# Altium project ARM_.PrjPcb
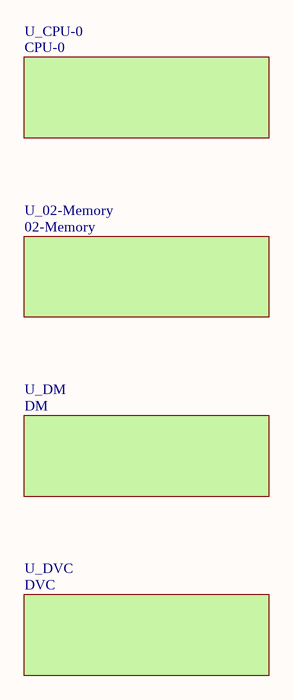
[diagram p0: Main.SchDoc]
5 sheets, 127 parts. Net scope: global (net labels, ports and power ports of the same name join across sheets).
Sheets:
  Main.SchDoc
    U_CPU-0 = CPU-0.SchDoc
    U_02-Memory = 02-Memory.SchDoc
    U_DM = DM.SchDoc
    U_DVC = DVC.SchDoc

## Sheet Main.SchDoc
size A4

### Sub-sheets
U_02-Memory = 02-Memory: no entries
U_CPU-0 = CPU-0: no entries
U_DM = DM: no entries
U_DVC = DVC: no entries

## Sheet CPU-0.SchDoc
size A3
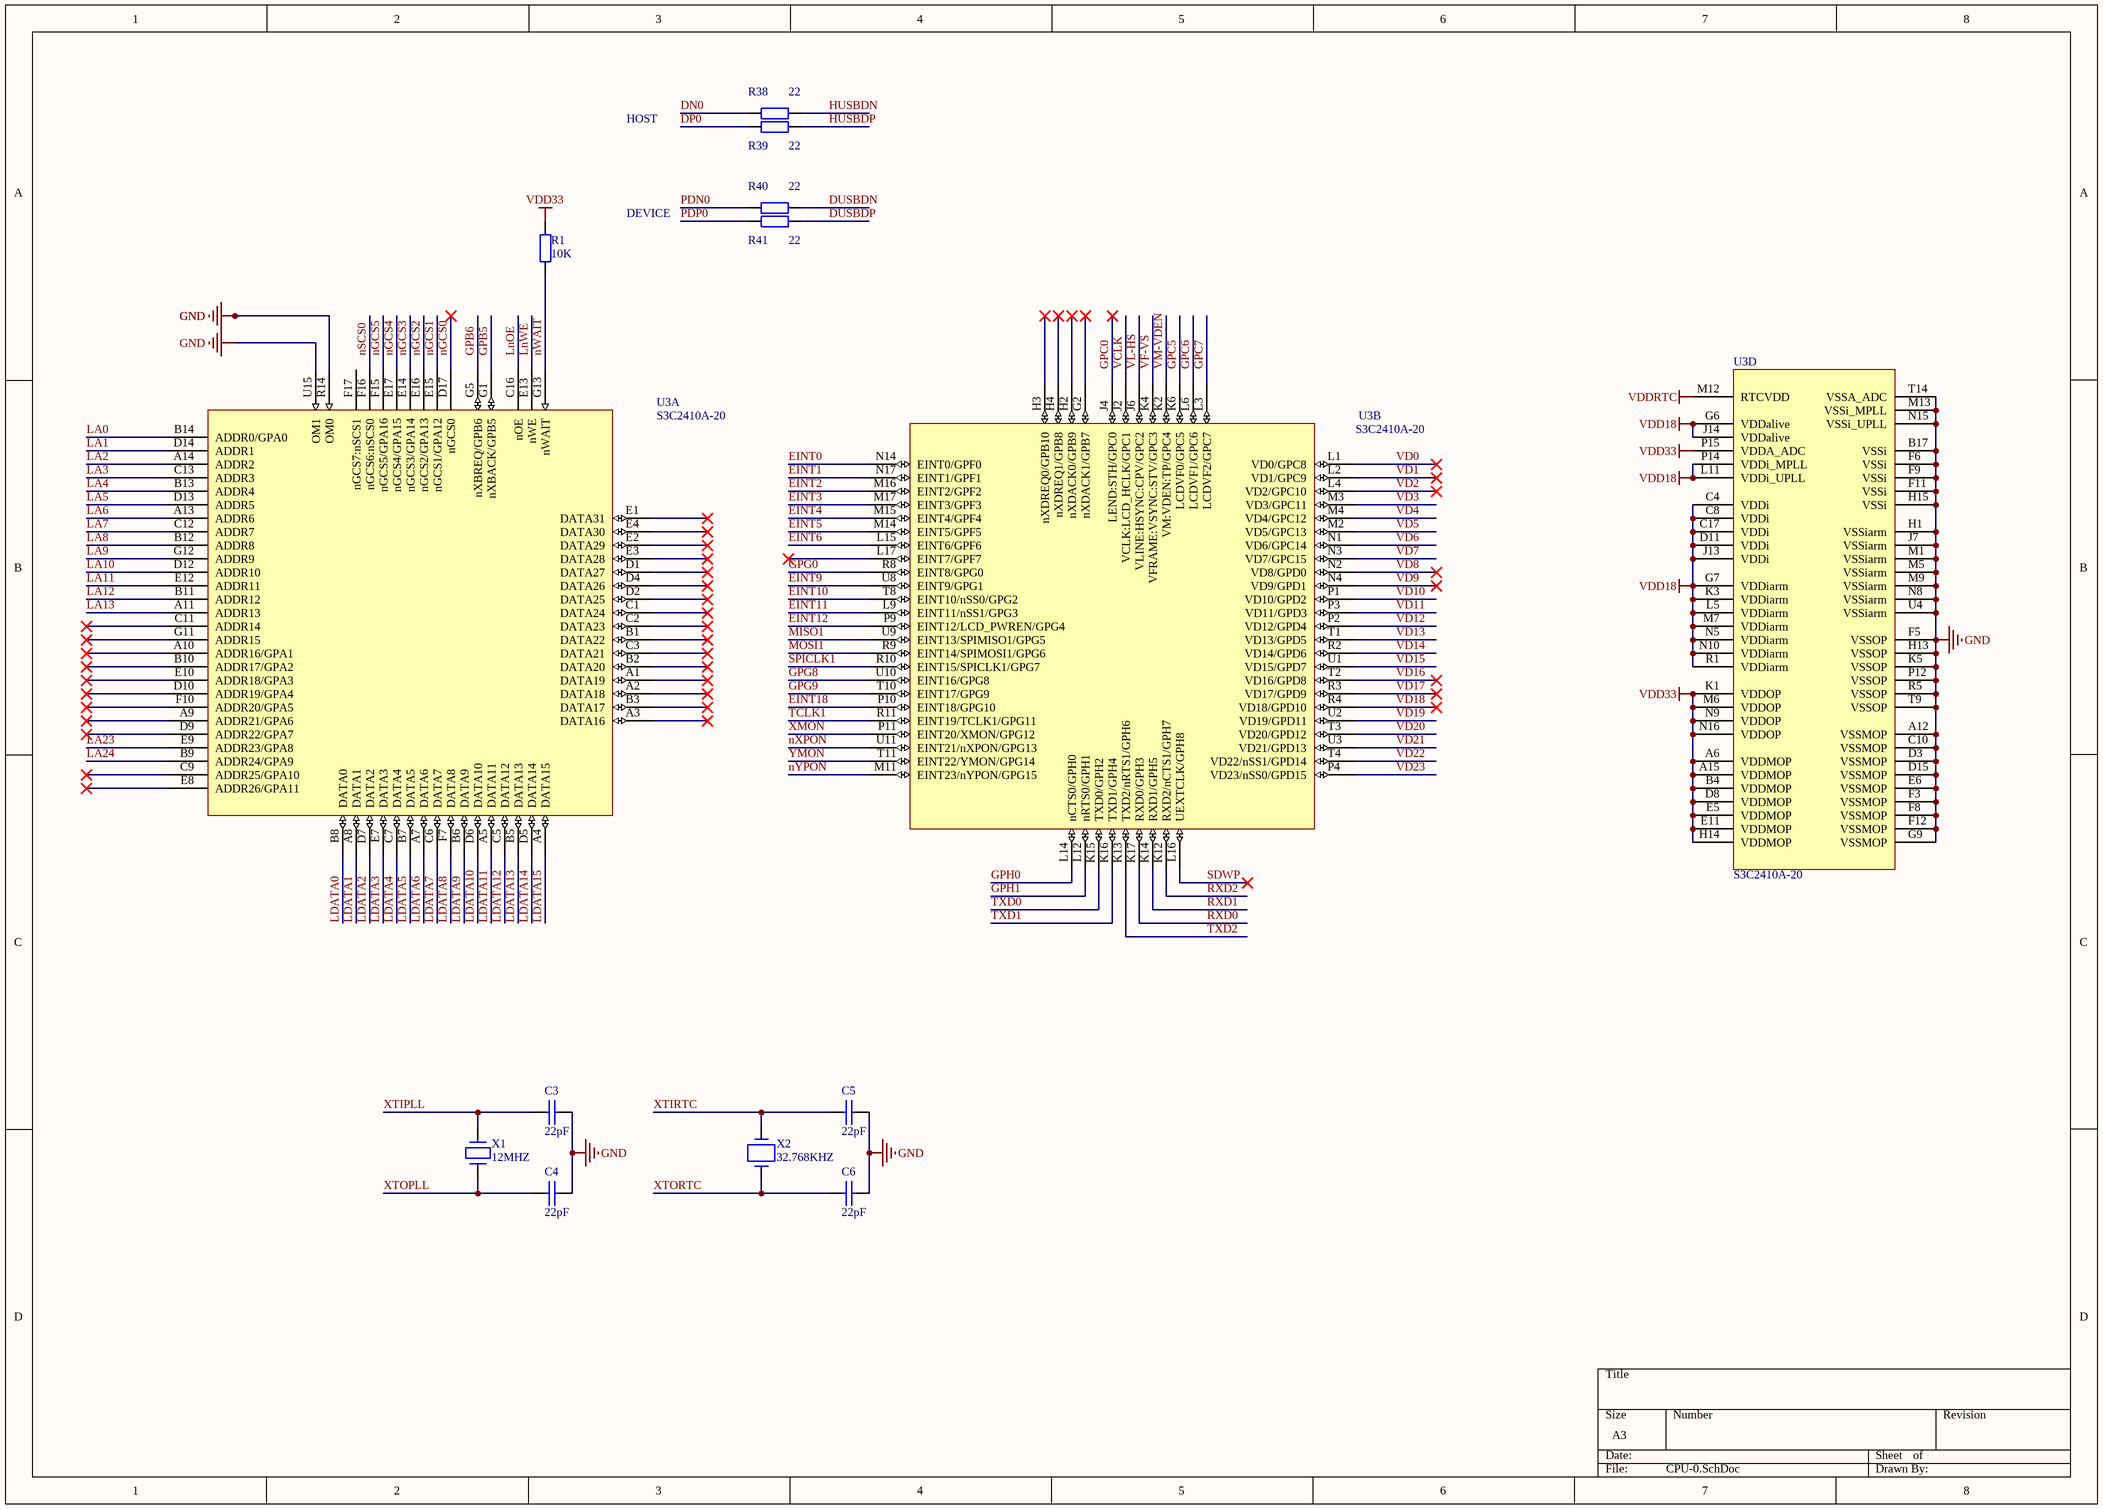
[diagram p1: CPU-0.SchDoc]

### Parts
C3  22pF  [A型钽电容]
C4  22pF  [A型钽电容]
C5  22pF  [A型钽电容]
C6  22pF  [A型钽电容]
R1  value 10K  [0603R]  (hidden comment: Res2)
R38  value 22  [0603R]  (hidden comment: Res2)
R39  value 22  [0603R]  (hidden comment: Res2)
R40  value 22  [0603R]  (hidden comment: Res2)
R41  value 22  [0603R]  (hidden comment: Res2)
U3  S3C2410A-20  [FBGA272]  (parts A,B,D of 4)
X1  12MHZ  [OSC2PR-1]
X2  32.768KHZ  [XTAL-B]

### Nets
GND: C3.2 C4.2 C5.2 C6.2 U3.A12(VSSMOP) U3.B17(VSSi) U3.C10(VSSMOP) U3.D3(VSSMOP) U3.D15(VSSMOP) U3.E6(VSSMOP) U3.F3(VSSMOP) U3.F5(VSSOP) U3.F6(VSSi) U3.F8(VSSMOP) U3.F9(VSSi) U3.F11(VSSi) U3.F12(VSSMOP) U3.G9(VSSMOP) U3.H1(VSSiarm) U3.H13(VSSOP) U3.H15(VSSi) U3.J7(VSSiarm) U3.K5(VSSOP) U3.M1(VSSiarm) U3.M5(VSSiarm) U3.M9(VSSiarm) U3.M13(VSSi_MPLL) U3.N8(VSSiarm) U3.N15(VSSi_UPLL) U3.P12(VSSOP) U3.R5(VSSOP) U3.R14(OM0) U3.T9(VSSOP) U3.T14(VSSA_ADC) U3.U4(VSSiarm) U3.U15(OM1)
RXD0: U3.K17(RXD0/GPH3)
RXD1: U3.K14(RXD1/GPH5)
TXD0: U3.K15(TXD0/GPH2)
TXD1: U3.K16(TXD1/GPH4)
VDD18: U3.C4(VDDi) U3.C8(VDDi) U3.C17(VDDi) U3.D11(VDDi) U3.G6(VDDalive) U3.G7(VDDiarm) U3.J13(VDDi) U3.J14(VDDalive) U3.K3(VDDiarm) U3.L5(VDDiarm) U3.L11(VDDi_UPLL) U3.M7(VDDiarm) U3.N5(VDDiarm) U3.N10(VDDiarm) U3.P14(VDDi_MPLL) U3.R1(VDDiarm)
VDD33: R1.2 U3.A6(VDDMOP) U3.A15(VDDMOP) U3.B4(VDDMOP) U3.D8(VDDMOP) U3.E5(VDDMOP) U3.E11(VDDMOP) U3.H14(VDDMOP) U3.K1(VDDOP) U3.M6(VDDOP) U3.N9(VDDOP) U3.N16(VDDOP) U3.P15(VDDA_ADC)
VDDRTC: U3.M12(RTCVDD)
DN0: R38.1
DP0: R39.1
DUSBDN: R40.2
DUSBDP: R41.2
EINT0: U3.N14(EINT0/GPF0)
EINT1: U3.N17(EINT1/GPF1)
EINT2: U3.M16(EINT2/GPF2)
EINT3: U3.M17(EINT3/GPF3)
EINT4: U3.M15(EINT4/GPF4)
EINT5: U3.M14(EINT5/GPF5)
EINT6: U3.L15(EINT6/GPF6)
EINT9: U3.U8(EINT9/GPG1)
EINT10: U3.T8(EINT10/nSS0/GPG2)
EINT11: U3.L9(EINT11/nSS1/GPG3)
EINT12: U3.P9(EINT12/LCD_PWREN/GPG4)
EINT18: U3.P10(EINT18/GPG10)
GPB5: U3.G1(nXBACK/GPB5)
GPB6: U3.G5(nXBREQ/GPB6)
GPC0: U3.J4(LEND:STH/GPC0)
GPC5: U3.K6(LCDVF0/GPC5)
GPC6: U3.L6(LCDVF1/GPC6)
GPC7: U3.L3(LCDVF2/GPC7)
GPG0: U3.R8(EINT8/GPG0)
GPG8: U3.U10(EINT16/GPG8)
GPG9: U3.T10(EINT17/GPG9)
GPH0: U3.L14(nCTS0/GPH0)
GPH1: U3.L12(nRTS0/GPH1)
HUSBDN: R38.2
HUSBDP: R39.2
LA0: U3.B14(ADDR0/GPA0)
LA1: U3.D14(ADDR1)
LA2: U3.A14(ADDR2)
LA3: U3.C13(ADDR3)
LA4: U3.B13(ADDR4)
LA5: U3.D13(ADDR5)
LA6: U3.A13(ADDR6)
LA7: U3.C12(ADDR7)
LA8: U3.B12(ADDR8)
LA9: U3.G12(ADDR9)
LA10: U3.D12(ADDR10)
LA11: U3.E12(ADDR11)
LA12: U3.B11(ADDR12)
LA13: U3.A11(ADDR13)
LA23: U3.E9(ADDR23/GPA8)
LA24: U3.B9(ADDR24/GPA9)
LDATA0: U3.B8(DATA0)
LDATA1: U3.A8(DATA1)
LDATA2: U3.D7(DATA2)
LDATA3: U3.E7(DATA3)
LDATA4: U3.C7(DATA4)
LDATA5: U3.B7(DATA5)
LDATA6: U3.A7(DATA6)
LDATA7: U3.C6(DATA7)
LDATA8: U3.F7(DATA8)
LDATA9: U3.B6(DATA9)
LDATA10: U3.D6(DATA10)
LDATA11: U3.A5(DATA11)
LDATA12: U3.C5(DATA12)
LDATA13: U3.B5(DATA13)
LDATA14: U3.D5(DATA14)
LDATA15: U3.A4(DATA15)
LnOE: U3.C16(nOE)
LnWE: U3.E13(nWE)
MISO1: U3.U9(EINT13/SPIMISO1/GPG5)
MOSI1: U3.R9(EINT14/SPIMOSI1/GPG6)
nGCS0: U3.D17(nGCS0)
nGCS1: U3.E15(nGCS1/GPA12)
nGCS2: U3.E16(nGCS2/GPA13)
nGCS3: U3.E14(nGCS3/GPA14)
nGCS4: U3.E17(nGCS4/GPA15)
nGCS5: U3.F15(nGCS5/GPA16)
nSCS0: U3.F16(nGCS6:nSCS0)
nWAIT: R1.1 U3.G13(nWAIT)
nXPON: U3.U11(EINT21/nXPON/GPG13)
nYPON: U3.M11(EINT23/nYPON/GPG15)
PDN0: R40.1
PDP0: R41.1
RXD2: U3.K12(RXD2/nCTS1/GPH7)
SDWP: U3.L16(UEXTCLK/GPH8)
SPICLK1: U3.R10(EINT15/SPICLK1/GPG7)
TCLK1: U3.R11(EINT19/TCLK1/GPG11)
TXD2: U3.K13(TXD2/nRTS1/GPH6)
VCLK: U3.J2(VCLK:LCD_HCLK/GPC1)
VD0: U3.L1(VD0/GPC8)
VD1: U3.L2(VD1/GPC9)
VD2: U3.L4(VD2/GPC10)
VD3: U3.M3(VD3/GPC11)
VD4: U3.M4(VD4/GPC12)
VD5: U3.M2(VD5/GPC13)
VD6: U3.N1(VD6/GPC14)
VD7: U3.N3(VD7/GPC15)
VD8: U3.N2(VD8/GPD0)
VD9: U3.N4(VD9/GPD1)
VD10: U3.P1(VD10/GPD2)
VD11: U3.P3(VD11/GPD3)
VD12: U3.P2(VD12/GPD4)
VD13: U3.T1(VD13/GPD5)
VD14: U3.R2(VD14/GPD6)
VD15: U3.U1(VD15/GPD7)
VD16: U3.T2(VD16/GPD8)
VD17: U3.R3(VD17/GPD9)
VD18: U3.R4(VD18/GPD10)
VD19: U3.U2(VD19/GPD11)
VD20: U3.T3(VD20/GPD12)
VD21: U3.U3(VD21/GPD13)
VD22: U3.T4(VD22/nSS1/GPD14)
VD23: U3.P4(VD23/nSS0/GPD15)
VF-VS: U3.K4(VFRAME:VSYNC:STV/GPC3)
VL-HS: U3.J6(VLINE:HSYNC:CPV/GPC2)
VM-VDEN: U3.K2(VM:VDEN:TP/GPC4)
XMON: U3.P11(EINT20/XMON/GPG12)
XTIPLL: C3.1 X1.2
XTIRTC: C5.1 X2.2
XTOPLL: C4.1 X1.1
XTORTC: C6.1 X2.1
YMON: U3.T11(EINT22/YMON/GPG14)

Not connected (* = marked no-connect by the designer): U3 A1(DATA19)* A2(DATA18)* A3(DATA16)* A9(ADDR21/GPA6)* A10(ADDR16/GPA1)* B1(DATA22)* B2(DATA20)* B3(DATA17)* B10(ADDR17/GPA2)* C1(DATA24)* C2(DATA23)* C3(DATA21)* C9(ADDR25/GPA10)* C11(ADDR14)* D1(DATA27)* D2(DATA25)* D4(DATA26)* D9(ADDR22/GPA7)* D10(ADDR19/GPA4)* E1(DATA31)* E2(DATA29)* E3(DATA28)* E4(DATA30)* E8(ADDR26/GPA11)* E10(ADDR18/GPA3)* F10(ADDR20/GPA5)* F17(nGCS7:nSCS1) G2(nXDACK1/GPB7)* G11(ADDR15)* H2(nXDACK0/GPB9)* H3(nXDREQ0/GPB10)* H4(nXDREQ1/GPB8)* L17(EINT7/GPF7)*

### Notes on the sheet
- HOST
- DEVICE

### Library data of the parts
C3-C6 = CAP_1: Capacitor
R1 R38-R41 = Res2_1: Resistor; Published: 8-Jun-2000; LatestRevisionDate: 17-Jul-2002; LatestRevisionNote: Re-released for DXP Platform.; PackageReference: AXIAL-0.4; Publisher: Altium Limited
U3 = S3C2410A-20: 32-Bit RISC Microprocessor, 200 MHz, 1.8V (Core), 3.3V (Memory and IO), 272-Pin FBGA; Published: 6-Oct-2005; LatestRevisionDate: 13-Apr-2006; LatestRevisionNote: IPC-7351 Footprint Added.; DatasheetVersion: rev1.0, Mar-2004; PackageVersion: Mar-2004; PackageReference: FBGA272; Publisher: Altium Limited; PackageDescription: 272-Ball Ball Grid Array 0.8 mm Pitch; ComponentLink1Description: Manufacturer Link; ComponentLink1URL: http://www.samsung.com; ComponentLink2Description: Datasheet; ComponentLink2URL: http://www.samsung.com/Products/Semiconductor/SystemLSI/MobileSolutions/MobileASSP/MobileComputing/S3C2410/um_s3c2410a_manual_r10.pdf
X1 = CRYSTAL: Part Field 1: 1; Part Field 5: 1; Part Field 6: 1000K
X2 = CRYSTAL_1: Text Field1: 20; Text Field2: 20

## Sheet 02-Memory.SchDoc
size A3
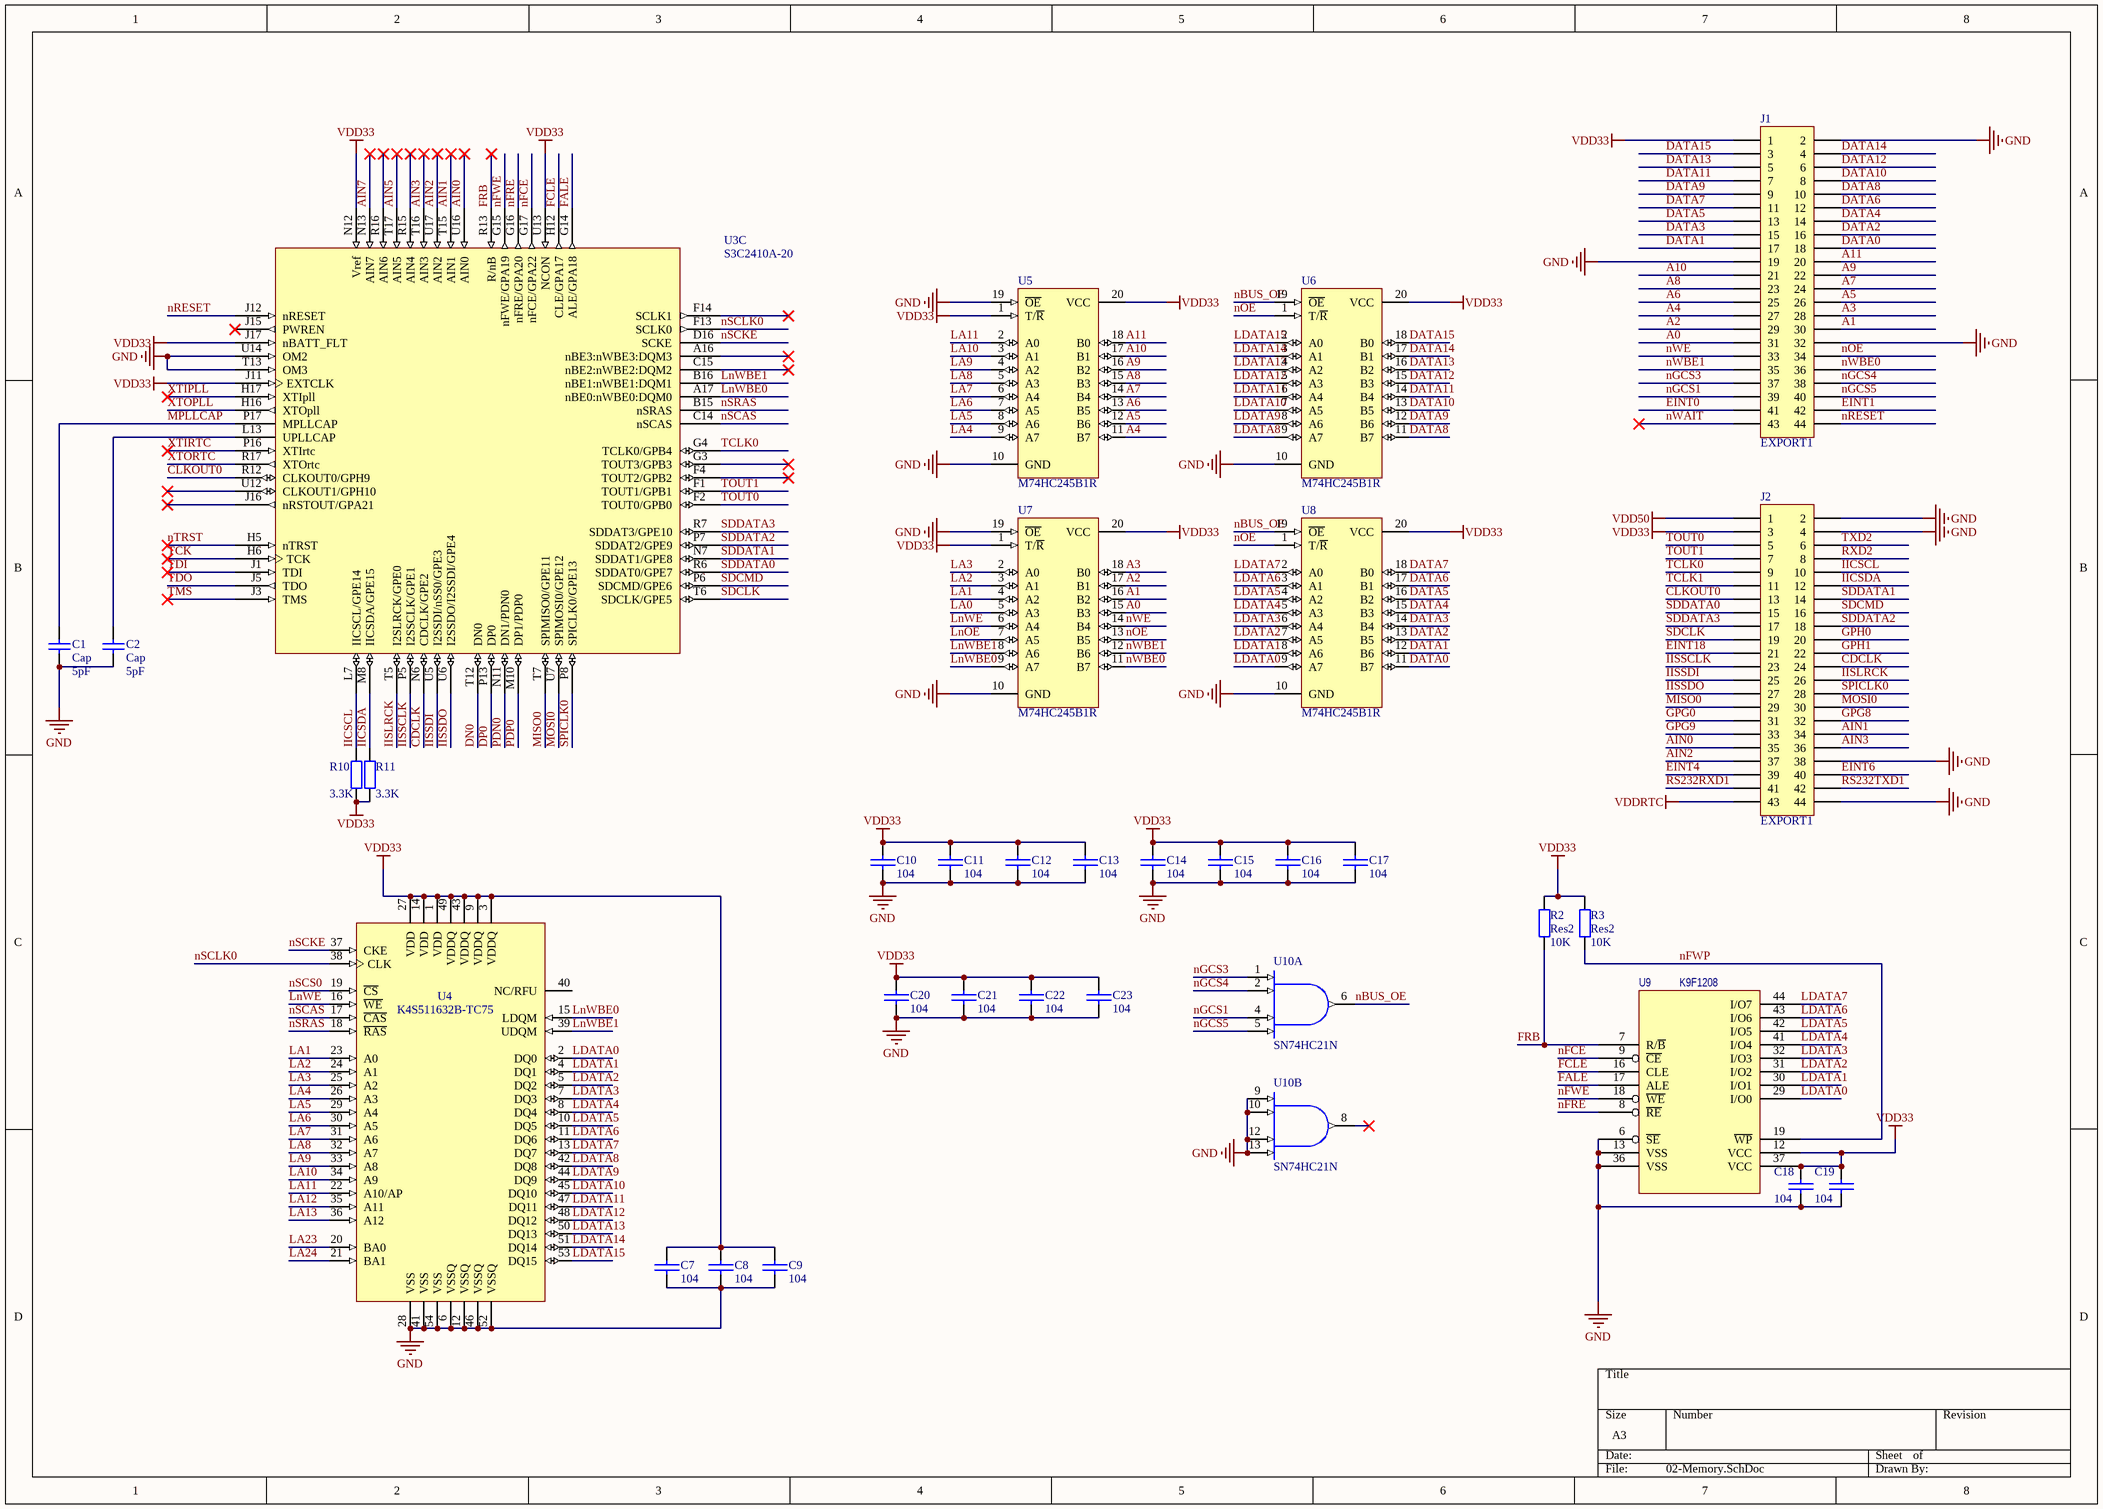
[diagram p2: 02-Memory.SchDoc]

### Parts
C1  Cap  value 5pF  [RAD-0.3]
C2  Cap  value 5pF  [RAD-0.3]
C7  104  [A型钽电容]
C8  104  [A型钽电容]
C9  104  [A型钽电容]
C10  104  [A型钽电容]
C11  104  [A型钽电容]
C12  104  [A型钽电容]
C13  104  [A型钽电容]
C14  104  [A型钽电容]
C15  104  [A型钽电容]
C16  104  [A型钽电容]
C17  104  [A型钽电容]
C18  104  [A型钽电容]
C19  104  [A型钽电容]
C20  104  [A型钽电容]
C21  104  [A型钽电容]
C22  104  [A型钽电容]
C23  104  [A型钽电容]
J1  EXPORT1  [HDR2X22]
J2  EXPORT1  [HDR2X22]
R2  Res2  value 10K  [0603R]
R3  Res2  value 10K  [0603R]
R10  value 3.3K  [0603R]  (hidden comment: Res2)
R11  value 3.3K  [0603R]  (hidden comment: Res2)
U3  S3C2410A-20  [FBGA272]  (part C of 4)
U4  K4S511632B-TC75  [54_TSOP2_400AF_N]
U5  M74HC245B1R  [SOP-20]
U6  M74HC245B1R  [SOP-20]
U7  M74HC245B1R  [SOP-20]
U8  M74HC245B1R  [SOP-20]
U9  K9F1208  [TSOP48]
U10  SN74HC21N  [N014]  (parts A,B of 2)

### Nets
GND: C1.1 C2.1 C7.2 C8.2 C9.2 C10.2 C11.2 C12.2 C13.2 C14.2 C15.2 C16.2 C17.2 C18.2 C19.2 C20.2 C21.2 C22.2 C23.2 J1.2 J1.19 J1.32 J2.2 J2.4 J2.38 J2.44 U3.T13(OM3) U3.U14(OM2) U4.6(VSSQ) U4.12(VSSQ) U4.28(VSS) U4.41(VSS) U4.46(VSSQ) U4.52(VSSQ) U4.54(VSS) U5.10(GND) U5.19(~{OE}) U6.10(GND) U7.10(GND) U7.19(~{OE}) U8.10(GND) U9.6(~{SE}) U9.13(VSS) U9.36(VSS) U10.7(GND) U10.9(A) U10.10(B) U10.12(C) U10.13(D)
nRESET: J1.44 U3.J12(nRESET)
nTRST: U3.H5(nTRST)
RS232RXD1: J2.41
RS232TXD1: J2.42
TCK: U3.H6(TCK)
TDI: U3.J1(TDI)
TDO: U3.J5(TDO)
TMS: U3.J3(TMS)
VCC: U10.14(VCC)
VDD33: C7.1 C8.1 C9.1 C10.1 C11.1 C12.1 C13.1 C14.1 C15.1 C16.1 C17.1 C18.1 C19.1 C20.1 C21.1 C22.1 C23.1 J1.1 J2.3 R2.2 R3.2 R10.1 R11.1 U3.J11(EXTCLK) U3.J17(nBATT_FLT) U3.N12(Vref) U3.U13(NCON) U4.1(VDD) U4.3(VDDQ) U4.9(VDDQ) U4.14(VDD) U4.27(VDD) U4.43(VDDQ) U4.49(VDDQ) U5.1(T/~{R}) U5.20(VCC) U6.20(VCC) U7.1(T/~{R}) U7.20(VCC) U8.20(VCC) U9.12(VCC) U9.37(VCC)
VDD50: J2.1
VDDRTC: J2.43
A0: J1.31 U7.15(B3)
A1: J1.30 U7.16(B2)
A2: J1.29 U7.17(B1)
A3: J1.28 U7.18(B0)
A4: J1.27 U5.11(B7)
A5: J1.26 U5.12(B6)
A6: J1.25 U5.13(B5)
A7: J1.24 U5.14(B4)
A8: J1.23 U5.15(B3)
A9: J1.22 U5.16(B2)
A10: J1.21 U5.17(B1)
A11: J1.20 U5.18(B0)
AIN0: J2.35 U3.U16(AIN0)
AIN1: J2.34 U3.T15(AIN1)
AIN2: J2.37 U3.U17(AIN2)
AIN3: J2.36 U3.T16(AIN3)
AIN5: U3.T17(AIN5)
AIN7: U3.N13(AIN7)
CDCLK: J2.24 U3.N6(CDCLK/GPE2)
CLKOUT0: J2.13 U3.R12(CLKOUT0/GPH9)
DATA0: J1.18 U8.11(B7)
DATA1: J1.17 U8.12(B6)
DATA2: J1.16 U8.13(B5)
DATA3: J1.15 U8.14(B4)
DATA4: J1.14 U8.15(B3)
DATA5: J1.13 U8.16(B2)
DATA6: J1.12 U8.17(B1)
DATA7: J1.11 U8.18(B0)
DATA8: J1.10 U6.11(B7)
DATA9: J1.9 U6.12(B6)
DATA10: J1.8 U6.13(B5)
DATA11: J1.7 U6.14(B4)
DATA12: J1.6 U6.15(B3)
DATA13: J1.5 U6.16(B2)
DATA14: J1.4 U6.17(B1)
DATA15: J1.3 U6.18(B0)
DN0: U3.T12(DN0)
DP0: U3.P13(DP0)
EINT0: J1.41
EINT1: J1.42
EINT4: J2.39
EINT6: J2.40
EINT18: J2.21
FALE: U3.G14(ALE/GPA18) U9.17(ALE)
FCLE: U3.H12(CLE/GPA17) U9.16(CLE)
FRB: R2.1 U3.R13(R/nB) U9.7(R/~{B})
GPG0: J2.31
GPG8: J2.32
GPG9: J2.33
GPH0: J2.20
GPH1: J2.22
IICSCL: J2.10 R10.2 U3.L7(IICSCL/GPE14)
IICSDA: J2.12 R11.2 U3.M8(IICSDA/GPE15)
IISLRCK: J2.26 U3.T5(I2SLRCK/GPE0)
IISSCLK: J2.23 U3.P5(I2SSCLK/GPE1)
IISSDI: J2.25 U3.U5(I2SSDI/nSS0/GPE3)
IISSDO: J2.27 U3.U6(I2SSDO/I2SSDI/GPE4)
LA0: U7.5(A3)
LA1: U4.23(A0) U7.4(A2)
LA2: U4.24(A1) U7.3(A1)
LA3: U4.25(A2) U7.2(A0)
LA4: U4.26(A3) U5.9(A7)
LA5: U4.29(A4) U5.8(A6)
LA6: U4.30(A5) U5.7(A5)
LA7: U4.31(A6) U5.6(A4)
LA8: U4.32(A7) U5.5(A3)
LA9: U4.33(A8) U5.4(A2)
LA10: U4.34(A9) U5.3(A1)
LA11: U4.22(A10/AP) U5.2(A0)
LA12: U4.35(A11)
LA13: U4.36(A12)
LA23: U4.20(BA0)
LA24: U4.21(BA1)
LDATA0: U4.2(DQ0) U8.9(A7) U9.29(I/O0)
LDATA1: U4.4(DQ1) U8.8(A6) U9.30(I/O1)
LDATA2: U4.5(DQ2) U8.7(A5) U9.31(I/O2)
LDATA3: U4.7(DQ3) U8.6(A4) U9.32(I/O3)
LDATA4: U4.8(DQ4) U8.5(A3) U9.41(I/O4)
LDATA5: U4.10(DQ5) U8.4(A2) U9.42(I/O5)
LDATA6: U4.11(DQ6) U8.3(A1) U9.43(I/O6)
LDATA7: U4.13(DQ7) U8.2(A0) U9.44(I/O7)
LDATA8: U4.42(DQ8) U6.9(A7)
LDATA9: U4.44(DQ9) U6.8(A6)
LDATA10: U4.45(DQ10) U6.7(A5)
LDATA11: U4.47(DQ11) U6.6(A4)
LDATA12: U4.48(DQ12) U6.5(A3)
LDATA13: U4.50(DQ13) U6.4(A2)
LDATA14: U4.51(DQ14) U6.3(A1)
LDATA15: U4.53(DQ15) U6.2(A0)
LnOE: U7.7(A5)
LnWBE0: U3.A17(nBE0:nWBE0:DQM0) U4.15(LDQM) U7.9(A7)
LnWBE1: U3.B16(nBE1:nWBE1:DQM1) U4.39(UDQM) U7.8(A6)
LnWE: U4.16(~{WE}) U7.6(A4)
MISO0: J2.29 U3.T7(SPIMISO0/GPE11)
MOSI0: J2.30 U3.U7(SPIMOSI0/GPE12)
MPLLCAP: C1.2 U3.P17(MPLLCAP)
nBUS_OE: U6.19(~{OE}) U8.19(~{OE}) U10.6(Y)
nFCE: U3.G17(nFCE/GPA22) U9.9(~{CE})
nFRE: U3.G16(nFRE/GPA20) U9.8(~{RE})
nFWE: U3.G15(nFWE/GPA19) U9.18(~{WE})
nFWP: R3.1 U9.19(~{WP})
nGCS1: J1.39 U10.4(C)
nGCS3: J1.37 U10.1(A)
nGCS4: J1.38 U10.2(B)
nGCS5: J1.40 U10.5(D)
nOE: J1.34 U6.1(T/~{R}) U7.13(B5) U8.1(T/~{R})
nSCAS: U3.C14(nSCAS) U4.17(~{CAS})
nSCKE: U3.D16(SCKE) U4.37(CKE)
nSCLK0: U3.F13(SCLK0) U4.38(CLK)
nSCS0: U4.19(~{CS})
nSRAS: U3.B15(nSRAS) U4.18(~{RAS})
nWAIT: J1.43
nWBE0: J1.36 U7.11(B7)
nWBE1: J1.35 U7.12(B6)
nWE: J1.33 U7.14(B4)
PDN0: U3.N11(DN1/PDN0)
PDP0: U3.M10(DP1/PDP0)
RXD2: J2.8
SDCLK: J2.19 U3.T6(SDCLK/GPE5)
SDCMD: J2.16 U3.P6(SDCMD/GPE6)
SDDATA0: J2.15 U3.R6(SDDAT0/GPE7)
SDDATA1: J2.14 U3.N7(SDDAT1/GPE8)
SDDATA2: J2.18 U3.P7(SDDAT2/GPE9)
SDDATA3: J2.17 U3.R7(SDDAT3/GPE10)
SPICLK0: J2.28 U3.P8(SPICLK0/GPE13)
TCLK0: J2.9 U3.G4(TCLK0/GPB4)
TCLK1: J2.11
TOUT0: J2.5 U3.F2(TOUT0/GPB0)
TOUT1: J2.7 U3.F1(TOUT1/GPB1)
TXD2: J2.6
XTIPLL: U3.H17(XTIpll)
XTIRTC: U3.P16(XTIrtc)
XTOPLL: U3.H16(XTOpll)
XTORTC: U3.R17(XTOrtc)
NetC2_2: C2.2 U3.L13(UPLLCAP)

Not connected (* = marked no-connect by the designer): U3 A16(nBE3:nWBE3:DQM3)* C15(nBE2:nWBE2:DQM2)* F4(TOUT2/GPB2)* F14(SCLK1)* G3(TOUT3/GPB3)* J15(PWREN)* J16(nRSTOUT/GPA21)* R15(AIN4)* R16(AIN6)* U12(CLKOUT1/GPH10)*; U4 40(NC/RFU); U10 8(Y)*

### Library data of the parts
C1 C2 = Cap: Capacitor; Published: 8-Jun-2000; LatestRevisionDate: 17-Jul-2002; LatestRevisionNote: Re-released for DXP Platform.; PackageReference: RAD-0.3; Publisher: Altium Limited; PackageDescription: Radial Cap, Thru-Hole; 2 Leads; 0.3 in Pin Spacing
C7-C23 = CAP_1: Capacitor
J1 J2 = Header 22X2: Header, 22-Pin, Dual row; LatestRevisionDate: 17-Jul-2002; LatestRevisionNote: Re-released for DXP Platform.; Publisher: Altium Limited
R2 R3 = Res2: Resistor; Published: 8-Jun-2000; LatestRevisionDate: 17-Jul-2002; LatestRevisionNote: Re-released for DXP Platform.; PackageReference: AXIAL-0.4; Publisher: Altium Limited
R10 R11 = Res2_1: Resistor; Published: 8-Jun-2000; LatestRevisionDate: 17-Jul-2002; LatestRevisionNote: Re-released for DXP Platform.; PackageReference: AXIAL-0.4; Publisher: Altium Limited
U3 = S3C2410A-20: as U3 on sheet CPU-0; Published: 6-Oct-2005; LatestRevisionDate: 13-Apr-2006; LatestRevisionNote: IPC-7351 Footprint Added.; DatasheetVersion: rev1.0, Mar-2004; PackageVersion: Mar-2004; PackageReference: FBGA272; Publisher: Altium Limited; PackageDescription: 272-Ball Ball Grid Array 0.8 mm Pitch; ComponentLink1Description: Manufacturer Link; ComponentLink1URL: http://www.samsung.com; ComponentLink2Description: Datasheet; ComponentLink2URL: http://www.samsung.com/Products/Semiconductor/SystemLSI/MobileSolutions/MobileASSP/MobileComputing/S3C2410/um_s3c2410a_manual_r10.pdf
U4 = K4S511632B-TC75: 512Mb Synchronous High Data Rate DRAM, 8Mb x 16Bit x 4 Banks, 54-Pin TSOP; Frequency: 133MHz (max); RowAddress: A0-A12; ColumnAddress: A0-A9; Published: 11-Oct-2004; LatestRevisionDate: 13-Apr-2006; LatestRevisionNote: IPC-7351 Footprint Added.; DatasheetVersion: rev1.1, Feb-2004; PackageVersion: Aug-2004; PackageReference: 54_TSOP2_400AF; Publisher: Altium Limited; PackageDescription: 54-Pin Small Outline Package 0.8 mm Pitch; ComponentLink1Description: Manufacturer Link; ComponentLink1URL: http://www.samsung.com; ComponentLink2Description: Datasheet; ComponentLink2URL: http://www.samsung.com/Products/Semiconductor/DRAM/SDRAM/SDRAMcomponent/512Mbit/K4S510432B/ds_sdr_512mb_b-die_x4x8x16_11.pdf
U5-U8 = M74HC245B1R: Octal Bus Transceiver 3-State Non-Inverting; Published: 8-Jun-2000; LatestRevisionDate: 06-Jun-2005; LatestRevisionNote: Stylized 3D Model Added.; DatasheetVersion: Oct-1993; PackageVersion: Jun-1998; PackageReference: DIP20; Publisher: Altium Limited; PackageDescription: DIP; 20 Leads; Row Spacing 7.62 mm; Pitch 2.54 mm; Code_JEDEC: MS-015-AE; ComponentLink1Description: Manufacturer Link; ComponentLink1URL: http://www.st.com/; ComponentLink2Description: Datasheet; ComponentLink2URL: http://www.st.com/stonline/products/literature/ds/1930/m74hc245.pdf
U9 = K9F2808
U10 = SN74HC21N: Dual 4-Input Positive-AND Gate; Note: Pins 3 and 11 are not connected and not drawn; Published: 8-Jun-2000; LatestRevisionDate: 04-Mar-2005; LatestRevisionNote: Stylized 3D Model Added.; DatasheetVersion: May-1997; PackageVersion: Oct-1995; PackageReference: N014; Publisher: Altium Limited; PackageDescription: DIP; 14 Leads; Row Spacing 7.62 mm; Pitch 2.54 mm; ComponentLink1Description: Manufacturer Link; ComponentLink1URL: http://www.ti.com/; ComponentLink2Description: Datasheet; ComponentLink2URL: http://www-s.ti.com/sc/ds/SN74HC21.pdf

## Sheet DM.SchDoc
size A4
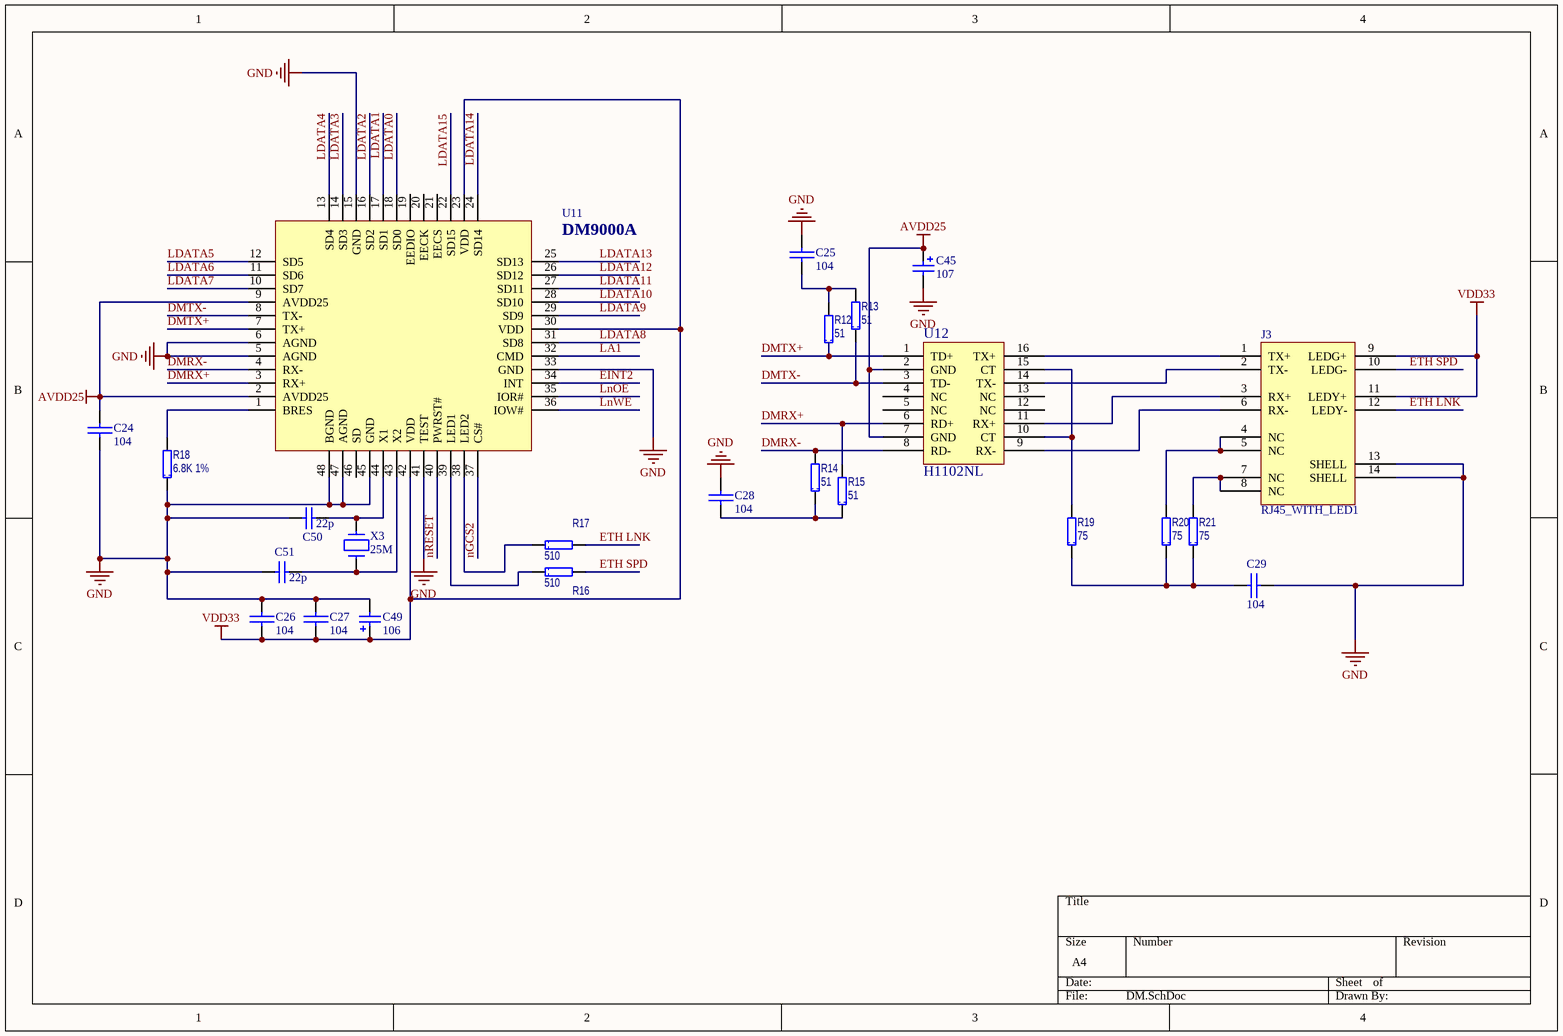
[diagram p3: DM.SchDoc]

### Parts
C24  104  [0603A]
C25  104  [0603A]
C26  104  [A型钽电容]
C27  104  [A型钽电容]
C28  104  [0603A]
C29  104  [A型钽电容]
C45  value 107  [POLAR0.8]  (hidden comment: Cap Pol2)
C49  value 106  [POLAR0.8]  (hidden comment: Cap Pol2)
C50  value 22p  [3225]  (hidden comment: Cap)
C51  value 22p  [3225]  (hidden comment: Cap)
J3  RJ45_WITH_LED1  [RJ45]
R12  51  [0603R]
R13  51  [0603R]
R14  51  [0603R]
R15  51  [0603R]
R16  510  [0603R]
R17  510  [0603R]
R18  6.8K 1%  [0603R]
R19  75  [0603R]
R20  75  [0603R]
R21  75  [0603R]
U11  DM9000A  [LQFP-48_M]
U12  H1102NL  [H1102]
X3  25M  [OSC2PR-1]

### Nets
AVDD25: C24.1 C45.1 U11.2(AVDD25) U11.9(AVDD25) U12.2(GND) U12.7(GND)
GND: C24.2 C25.1 C26.1 C27.1 C28.1 C29.2 C45.2 C49.2 C50.1 C51.1 J3.13(SHELL) J3.14(SHELL) R18.1 U11.5(AGND) U11.6(AGND) U11.15(GND) U11.33(GND) U11.41(TEST) U11.45(GND) U11.47(AGND) U11.48(BGND)
nRESET: U11.40(PWRST#)
VDD33: C26.2 C27.2 C49.1 J3.9(LEDG+) J3.11(LEDY+) U11.23(VDD) U11.30(VDD) U11.42(VDD)
DMRX+: R15.2 U11.3(RX+) U12.6(RD+)
DMRX-: R14.2 U11.4(RX-) U12.8(RD-)
DMTX+: R12.1 U11.7(TX+) U12.1(TD+)
DMTX-: R13.1 U11.8(TX-) U12.3(TD-)
EINT2: U11.34(INT)
ETH LNK: J3.12(LEDY-) R17.2
ETH SPD: J3.10(LEDG-) R16.2
LA1: U11.32(CMD)
LDATA0: U11.18(SD0)
LDATA1: U11.17(SD1)
LDATA2: U11.16(SD2)
LDATA3: U11.14(SD3)
LDATA4: U11.13(SD4)
LDATA5: U11.12(SD5)
LDATA6: U11.11(SD6)
LDATA7: U11.10(SD7)
LDATA8: U11.31(SD8)
LDATA9: U11.29(SD9)
LDATA10: U11.28(SD10)
LDATA11: U11.27(SD11)
LDATA12: U11.26(SD12)
LDATA13: U11.25(SD13)
LDATA14: U11.24(SD14)
LDATA15: U11.22(SD15)
LnOE: U11.35(IOR#)
LnWE: U11.36(IOW#)
nGCS2: U11.37(CS#)
NetC25_2: C25.2 R12.2 R13.2
NetC28_2: C28.2 R14.1 R15.1
NetC29_1: C29.1 R19.1 R20.1 R21.1
NetC50_2: C50.2 U11.44(X1) X3.2
NetC51_2: C51.2 U11.43(X2) X3.1
NetJ3_1: J3.1(TX+) U12.16(TX+)
NetJ3_2: J3.2(TX-) U12.14(TX-)
NetJ3_3: J3.3(RX+) U12.11(RX+)
NetJ3_4: J3.4(NC) J3.5(NC) R20.2
NetJ3_6: J3.6(RX-) U12.9(RX-)
NetJ3_7: J3.7(NC) J3.8(NC) R21.2
NetR16_1: R16.1 U11.39(LED1)
NetR17_1: R17.1 U11.38(LED2)
NetR18_2: R18.2 U11.1(BRES)
NetR19_2: R19.2 U12.10(CT) U12.15(CT)

Not connected (* = marked no-connect by the designer): U11 19(EEDIO) 20(EECK) 21(EECS) 46(SD); U12 4(NC) 5(NC) 12(NC) 13(NC)

### Library data of the parts
C24 = CAP_3
C25 C28 = CAP_2: Capacitor
C26 C27 C29 = CAP_1: Capacitor
C45 C49 = Cap Pol2: Polarized Capacitor (Axial); Published: 8-Jun-2000; LatestRevisionDate: 17-Jul-2002; LatestRevisionNote: Re-released for DXP Platform.; PackageReference: POLAR0.8; Publisher: Altium Limited; PackageDescription: Polarized Capacitor; 2 Leads
C50 C51 = Cap: Capacitor; Published: 8-Jun-2000; LatestRevisionDate: 17-Jul-2002; LatestRevisionNote: Re-released for DXP Platform.; PackageReference: RAD-0.3; Publisher: Altium Limited
R12-R21 = RES
U11 = DM9000A: 网络芯片
U12 = H1012
X3 = CRYSTAL_2

## Sheet DVC.SchDoc
size A3
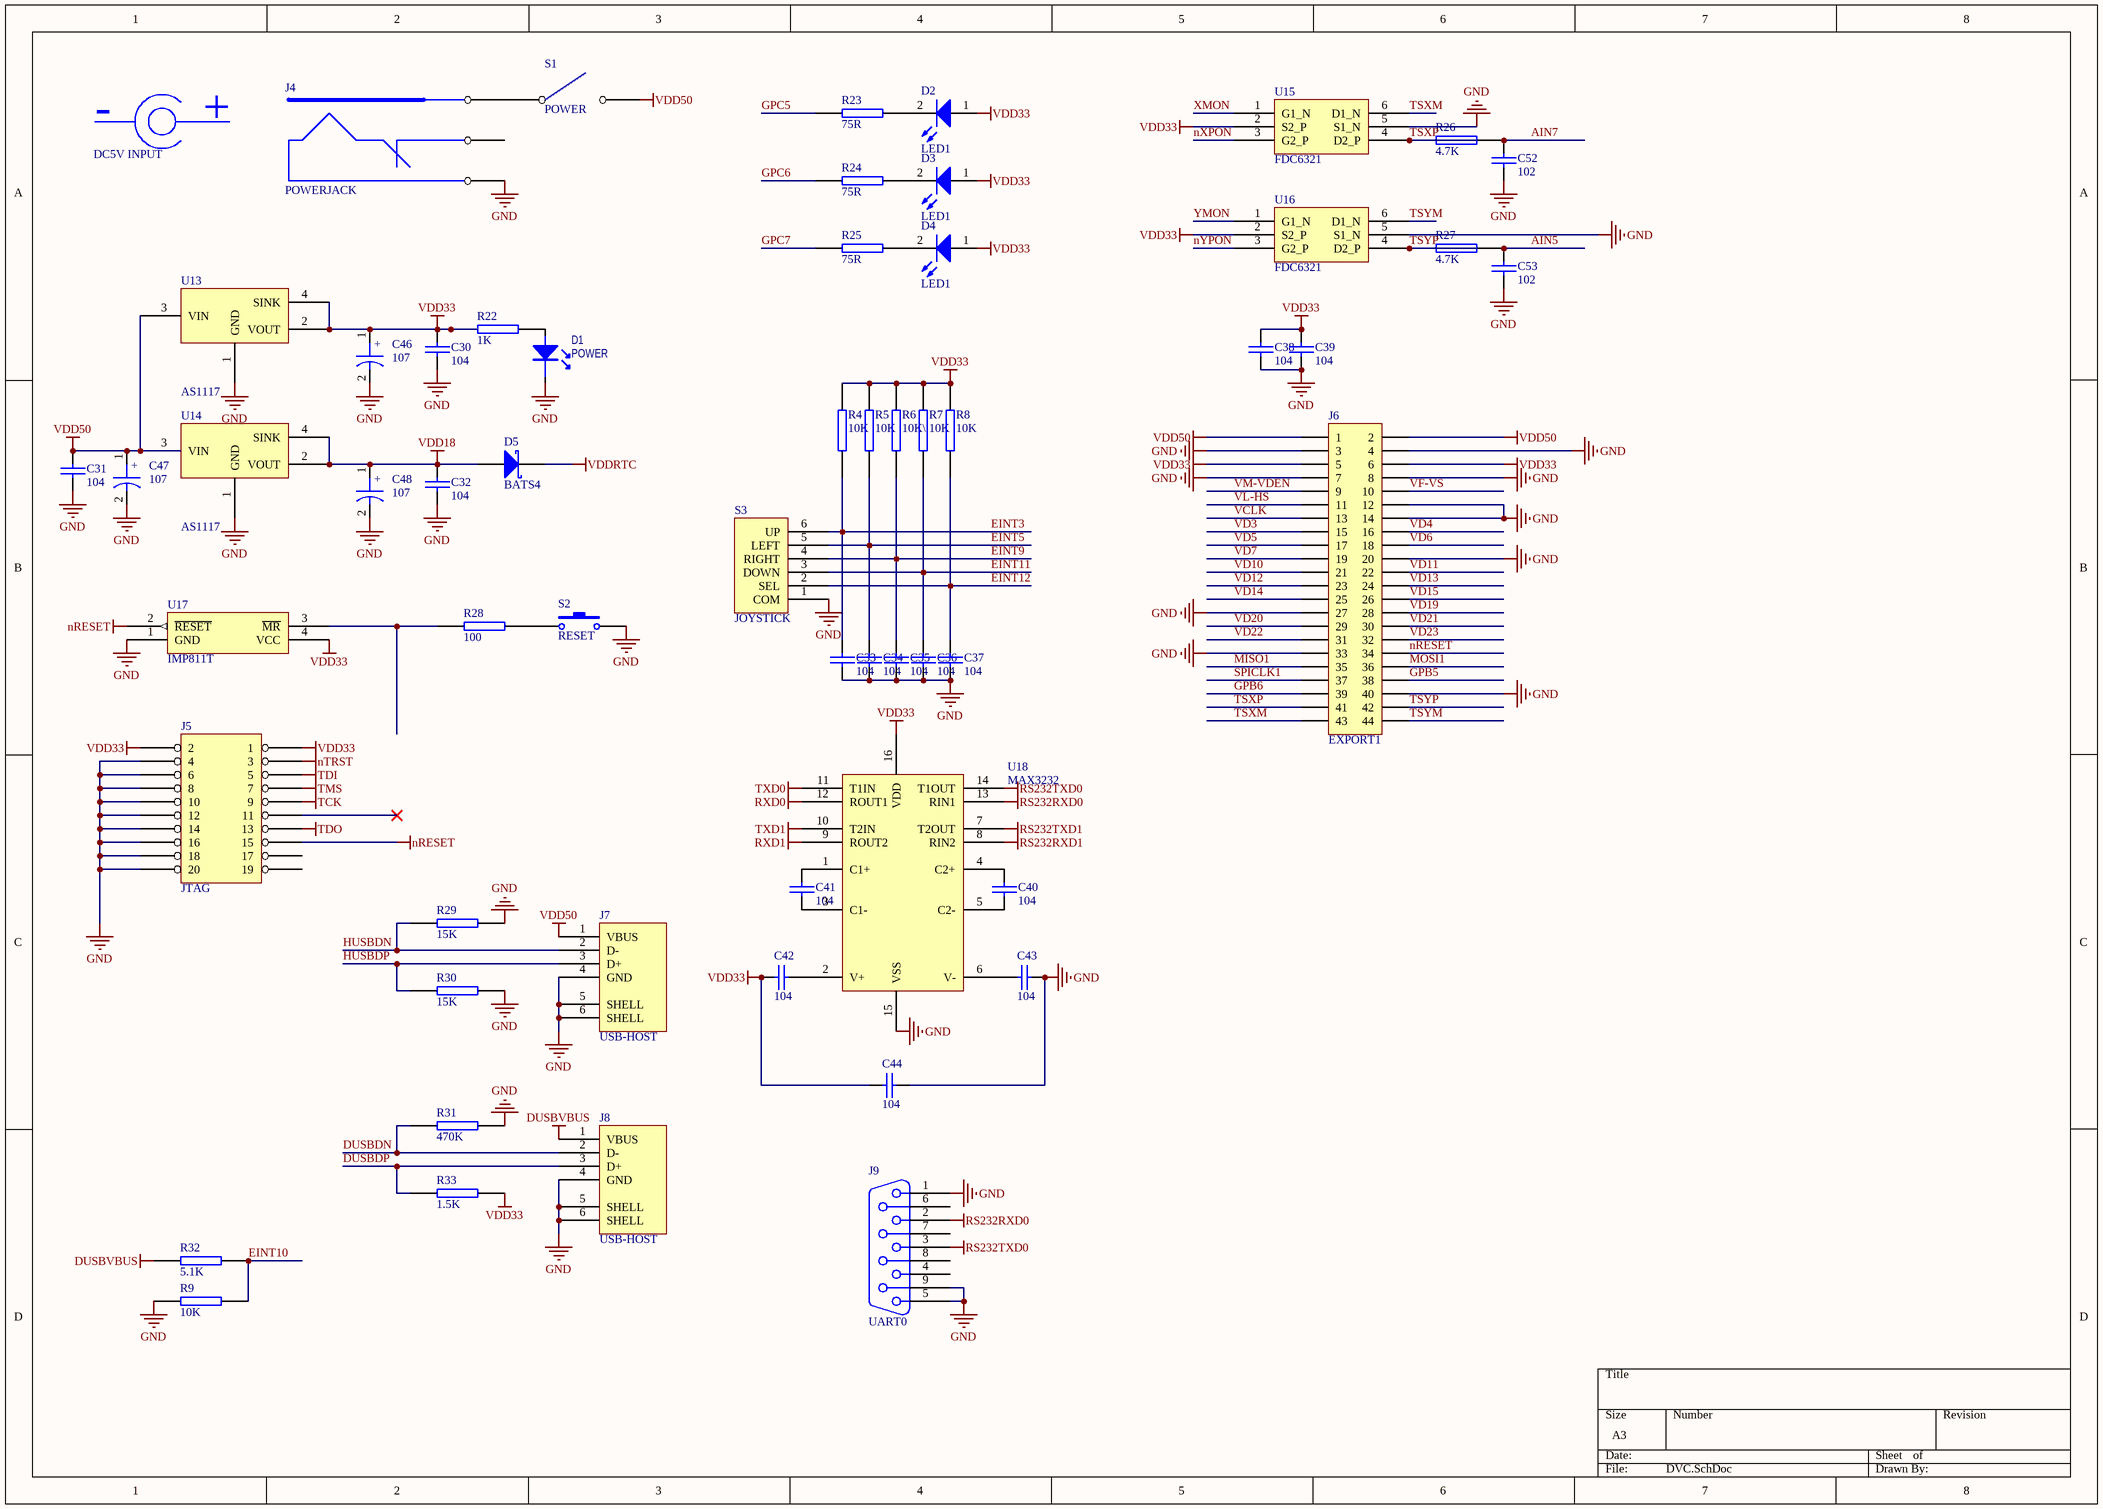
[diagram p4: DVC.SchDoc]

### Parts
?  DC5V INPUT
C30  104  [A型钽电容]
C31  104  [A型钽电容]
C32  104  [A型钽电容]
C33  104  [A型钽电容]
C34  104  [A型钽电容]
C35  104  [A型钽电容]
C36  104  [A型钽电容]
C37  104  [A型钽电容]
C38  104  [0603A]
C39  104  [0603A]
C40  104  [A型钽电容]
C41  104  [A型钽电容]
C42  104  [A型钽电容]
C43  104  [A型钽电容]
C44  104  [A型钽电容]
C46  107  [3216A]
C47  107  [3216A]
C48  107  [3216A]
C52  102  [0603A]
C53  102  [0603A]
D1  POWER  [LED]
D2  LED1  [LED0603]
D3  LED1  [LED0603]
D4  LED1  [LED0603]
D5  BATS4  [SFM-T2(3)/X1.7V]
J4  POWERJACK
J5  JTAG
J6  EXPORT1  [HDR2X22]
J7  USB-HOST
J8  USB-HOST
J9  UART0  [DB9RA/M]
R4  10K  [1206]
R5  10K  [1206]
R6  10K\  [1206]
R7  10K  [1206]
R8  10K  [1206]
R9  10K  [1206]
R22  1K  [1206]
R23  75R  [1206]
R24  75R  [1206]
R25  75R  [1206]
R26  4.7K  [1206]
R27  4.7K  [1206]
R28  100  [1206]
R29  15K  [1206]
R30  15K  [1206]
R31  470K  [1206]
R32  5.1K  [1206]
R33  1.5K  [1206]
S1  POWER
S2  RESET  [SPST-2]
S3  JOYSTICK
U13  AS1117
U14  AS1117
U15  FDC6321
U16  FDC6321
U17  IMP811T
U18  MAX3232  [SSOP16]

### Nets
DUSBVBUS: J8.1(VBUS) R32.1
GND: C30.2 C31.2 C32.2 C33.2 C34.2 C35.2 C36.2 C37.2 C38.2 C39.2 C43.1 C44.2 C46.2 C47.2 C48.2 C52.2 C53.2 D1.2 J4.3 J5.?2(4) J5.?3(6) J5.?4(8) J5.?5(10) J5.?6(12) J5.?7(14) J5.?8(16) J5.?9(18) J5.?10(20) J6.3 J6.4 J6.7 J6.8 J6.12 J6.14 J6.20 J6.27 J6.33 J6.40 J7.4(GND) J7.5(SHELL) J7.6(SHELL) J8.4(GND) J8.5(SHELL) J8.6(SHELL) J9.1 J9.5 J9.9 R9.1 R29.2 R30.2 R31.2 S2.2 S3.1(COM) U13.1(GND) U14.1(GND) U15.5(S1_N) U16.5(S1_N) U17.1(GND) U18.15(VSS)
nRESET: J5.?13(15) J6.34 U17.2(~{RESET})
nTRST: J5.?19(3)
RS232RXD0: J9.2 U18.13(RIN1)
RS232RXD1: U18.8(RIN2)
RS232TXD0: J9.3 U18.14(T1OUT)
RS232TXD1: U18.7(T2OUT)
RXD0: U18.12(ROUT1)
RXD1: U18.9(ROUT2)
TCK: J5.?16(9)
TDI: J5.?18(5)
TDO: J5.?14(13)
TMS: J5.?17(7)
TXD0: U18.11(T1IN)
TXD1: U18.10(T2IN)
VDD18: C32.1 C48.1 D5.3(A) U14.2(VOUT) U14.4(SINK)
VDD33: C30.1 C38.1 C39.1 C42.1 C44.1 C46.1 D2.1(A) D3.1(A) D4.1(A) J5.?1(2) J5.?20(1) J6.5 J6.6 R4.2 R5.2 R6.2 R7.2 R8.2 R22.1 R33.2 U13.2(VOUT) U13.4(SINK) U15.2(S2_P) U16.2(S2_P) U17.4(VCC) U18.16(VDD)
VDD50: C31.1 C47.1 J6.1 J6.2 J7.1(VBUS) S1.45 U13.3(VIN) U14.3(VIN)
VDDRTC: D5.1(K)
AIN5: C53.1 R27.2
AIN7: C52.1 R26.2
DUSBDN: J8.2(D-) R31.1
DUSBDP: J8.3(D+) R33.1
EINT3: C33.1 R4.1 S3.6(UP)
EINT5: C34.1 R5.1 S3.5(LEFT)
EINT9: C35.1 R6.1 S3.4(RIGHT)
EINT10: R9.2 R32.2
EINT11: C36.1 R7.1 S3.3(DOWN)
EINT12: C37.1 R8.1 S3.2(SEL)
GPB5: J6.38
GPB6: J6.39
GPC5: R23.1
GPC6: R24.1
GPC7: R25.1
HUSBDN: J7.2(D-) R29.1
HUSBDP: J7.3(D+) R30.1
MISO1: J6.35
MOSI1: J6.36
nXPON: U15.3(G2_P)
nYPON: U16.3(G2_P)
SPICLK1: J6.37
TSXM: J6.43 U15.6(D1_N)
TSXP: J6.41 R26.1 U15.4(D2_P)
TSYM: J6.44 U16.6(D1_N)
TSYP: J6.42 R27.1 U16.4(D2_P)
VCLK: J6.13
VD3: J6.15
VD4: J6.16
VD5: J6.17
VD6: J6.18
VD7: J6.19
VD10: J6.21
VD11: J6.22
VD12: J6.23
VD13: J6.24
VD14: J6.25
VD15: J6.26
VD19: J6.28
VD20: J6.29
VD21: J6.30
VD22: J6.31
VD23: J6.32
VF-VS: J6.10
VL-HS: J6.11
VM-VDEN: J6.9
XMON: U15.1(G1_N)
YMON: U16.1(G1_N)
NetC40_1: C40.1 U18.4(C2+)
NetC40_2: C40.2 U18.5(C2-)
NetC41_1: C41.1 U18.1(C1+)
NetC41_2: C41.2 U18.3(C1-)
NetC42_2: C42.2 U18.2(V+)
NetC43_2: C43.2 U18.6(V-)
NetD1_1: D1.1 R22.2
NetD2_2: D2.2(K) R23.2
NetD3_2: D3.2(K) R24.2
NetD4_2: D4.2(K) R25.2
NetJ4_1: J4.1 S1.44
NetR28_1: R28.1 U17.3(~{MR})
NetR28_2: R28.2 S2.1

Not connected (* = marked no-connect by the designer): J4 2; J5 ?11(19) ?12(17) ?15(11)*; J9 4 6 7 8

### Notes on the sheet
- (in symbol CAPACITOR POL_0) +
- (in symbol DC5V INPUT) -; +

### Library data of the parts
C30-C37 C40-C44 = CAP_1: Capacitor
C38 C39 C52 C53 = CAP_2: Capacitor
C46-C48 = CAPACITOR POL_0: Text Field1: 20; Text Field2: 20
D1 = LED
D2-D4 = LED0: Typical INFRARED GaAs LED; Published: 8-Jun-2000; LatestRevisionDate: 08-Jul-2005; LatestRevisionNote: Mech Layer 1 removed.; PackageReference: LED1; Publisher: Altium Limited
D5 = Diode 10TQ035: Schottky Rectifier; Note: Terminal 2 is the TAB and is electrically connected to the cathode; Published: 8-Jun-2000; LatestRevisionDate: 17-Jul-2002; LatestRevisionNote: Re-released for DXP Platform.; DatasheetVersion: PD-2.057B; PackageVersion: Feb-1998; PackageReference: TO-220AC; Publisher: Altium Limited; ComponentLink1Description: Manufacturer Link; ComponentLink1URL: http://www.irf.com/; ComponentLink2Description: Datasheet; ComponentLink2URL: http://www.irf.com/product-info/datasheets/data/10tq.pdf
J5 = JTAG20
J6 = Header 22X2: Header, 22-Pin, Dual row; LatestRevisionDate: 17-Jul-2002; LatestRevisionNote: Re-released for DXP Platform.; Publisher: Altium Limited
J7 J8 = USB
J9 = CONNECTOR DB9: Text Field1: 30; Text Field2: 100
R4-R9 R22-R33 = RES2_2
S2 = SW-PB: Switch; Published: 24-Mar-1999; LatestRevisionDate: 17-Jul-2002; LatestRevisionNote: Re-released for DXP Platform.; PackageReference: SPST-2; Publisher: Altium Limited
U17 = IMP811
U18 = MAX232SOP

## Nets that join several sheets
GND: CPU-0 (36 pins), 02-Memory (49 pins), DM (21 pins), DVC (59 pins)
nRESET: 02-Memory (J1.44 U3.J12), DM (U11.40), DVC (J5.?13 J6.34 U17.2)
nTRST: 02-Memory (U3.H5), DVC (J5.?19)
RS232RXD1: 02-Memory (J2.41), DVC (U18.8)
RS232TXD1: 02-Memory (J2.42), DVC (U18.7)
RXD0: CPU-0 (U3.K17), DVC (U18.12)
RXD1: CPU-0 (U3.K14), DVC (U18.9)
TCK: 02-Memory (U3.H6), DVC (J5.?16)
TDI: 02-Memory (U3.J1), DVC (J5.?18)
TDO: 02-Memory (U3.J5), DVC (J5.?14)
TMS: 02-Memory (U3.J3), DVC (J5.?17)
TXD0: CPU-0 (U3.K15), DVC (U18.11)
TXD1: CPU-0 (U3.K16), DVC (U18.10)
VDD18: CPU-0 (16 pins), DVC (5 pins)
VDD33: CPU-0 (13 pins), 02-Memory (42 pins), DM (8 pins), DVC (26 pins)
VDD50: 02-Memory (J2.1), DVC (8 pins)
VDDRTC: CPU-0 (U3.M12), 02-Memory (J2.43), DVC (D5.1)
AIN5: 02-Memory (U3.T17), DVC (C53.1 R27.2)
AIN7: 02-Memory (U3.N13), DVC (C52.1 R26.2)
DN0: CPU-0 (R38.1), 02-Memory (U3.T12)
DP0: CPU-0 (R39.1), 02-Memory (U3.P13)
DUSBDN: CPU-0 (R40.2), DVC (J8.2 R31.1)
DUSBDP: CPU-0 (R41.2), DVC (J8.3 R33.1)
EINT0: CPU-0 (U3.N14), 02-Memory (J1.41)
EINT1: CPU-0 (U3.N17), 02-Memory (J1.42)
EINT2: CPU-0 (U3.M16), DM (U11.34)
EINT3: CPU-0 (U3.M17), DVC (C33.1 R4.1 S3.6)
EINT4: CPU-0 (U3.M15), 02-Memory (J2.39)
EINT5: CPU-0 (U3.M14), DVC (C34.1 R5.1 S3.5)
EINT6: CPU-0 (U3.L15), 02-Memory (J2.40)
EINT9: CPU-0 (U3.U8), DVC (C35.1 R6.1 S3.4)
EINT10: CPU-0 (U3.T8), DVC (R9.2 R32.2)
EINT11: CPU-0 (U3.L9), DVC (C36.1 R7.1 S3.3)
EINT12: CPU-0 (U3.P9), DVC (C37.1 R8.1 S3.2)
EINT18: CPU-0 (U3.P10), 02-Memory (J2.21)
GPB5: CPU-0 (U3.G1), DVC (J6.38)
GPB6: CPU-0 (U3.G5), DVC (J6.39)
GPC5: CPU-0 (U3.K6), DVC (R23.1)
GPC6: CPU-0 (U3.L6), DVC (R24.1)
GPC7: CPU-0 (U3.L3), DVC (R25.1)
GPG0: CPU-0 (U3.R8), 02-Memory (J2.31)
GPG8: CPU-0 (U3.U10), 02-Memory (J2.32)
GPG9: CPU-0 (U3.T10), 02-Memory (J2.33)
GPH0: CPU-0 (U3.L14), 02-Memory (J2.20)
GPH1: CPU-0 (U3.L12), 02-Memory (J2.22)
HUSBDN: CPU-0 (R38.2), DVC (J7.2 R29.1)
HUSBDP: CPU-0 (R39.2), DVC (J7.3 R30.1)
LA0: CPU-0 (U3.B14), 02-Memory (U7.5)
LA1: CPU-0 (U3.D14), 02-Memory (U4.23 U7.4), DM (U11.32)
LA2: CPU-0 (U3.A14), 02-Memory (U4.24 U7.3)
LA3: CPU-0 (U3.C13), 02-Memory (U4.25 U7.2)
LA4: CPU-0 (U3.B13), 02-Memory (U4.26 U5.9)
LA5: CPU-0 (U3.D13), 02-Memory (U4.29 U5.8)
LA6: CPU-0 (U3.A13), 02-Memory (U4.30 U5.7)
LA7: CPU-0 (U3.C12), 02-Memory (U4.31 U5.6)
LA8: CPU-0 (U3.B12), 02-Memory (U4.32 U5.5)
LA9: CPU-0 (U3.G12), 02-Memory (U4.33 U5.4)
LA10: CPU-0 (U3.D12), 02-Memory (U4.34 U5.3)
LA11: CPU-0 (U3.E12), 02-Memory (U4.22 U5.2)
LA12: CPU-0 (U3.B11), 02-Memory (U4.35)
LA13: CPU-0 (U3.A11), 02-Memory (U4.36)
LA23: CPU-0 (U3.E9), 02-Memory (U4.20)
LA24: CPU-0 (U3.B9), 02-Memory (U4.21)
LDATA0: CPU-0 (U3.B8), 02-Memory (U4.2 U8.9 U9.29), DM (U11.18)
LDATA1: CPU-0 (U3.A8), 02-Memory (U4.4 U8.8 U9.30), DM (U11.17)
LDATA2: CPU-0 (U3.D7), 02-Memory (U4.5 U8.7 U9.31), DM (U11.16)
LDATA3: CPU-0 (U3.E7), 02-Memory (U4.7 U8.6 U9.32), DM (U11.14)
LDATA4: CPU-0 (U3.C7), 02-Memory (U4.8 U8.5 U9.41), DM (U11.13)
LDATA5: CPU-0 (U3.B7), 02-Memory (U4.10 U8.4 U9.42), DM (U11.12)
LDATA6: CPU-0 (U3.A7), 02-Memory (U4.11 U8.3 U9.43), DM (U11.11)
LDATA7: CPU-0 (U3.C6), 02-Memory (U4.13 U8.2 U9.44), DM (U11.10)
LDATA8: CPU-0 (U3.F7), 02-Memory (U4.42 U6.9), DM (U11.31)
LDATA9: CPU-0 (U3.B6), 02-Memory (U4.44 U6.8), DM (U11.29)
LDATA10: CPU-0 (U3.D6), 02-Memory (U4.45 U6.7), DM (U11.28)
LDATA11: CPU-0 (U3.A5), 02-Memory (U4.47 U6.6), DM (U11.27)
LDATA12: CPU-0 (U3.C5), 02-Memory (U4.48 U6.5), DM (U11.26)
LDATA13: CPU-0 (U3.B5), 02-Memory (U4.50 U6.4), DM (U11.25)
LDATA14: CPU-0 (U3.D5), 02-Memory (U4.51 U6.3), DM (U11.24)
LDATA15: CPU-0 (U3.A4), 02-Memory (U4.53 U6.2), DM (U11.22)
LnOE: CPU-0 (U3.C16), 02-Memory (U7.7), DM (U11.35)
LnWE: CPU-0 (U3.E13), 02-Memory (U4.16 U7.6), DM (U11.36)
MISO1: CPU-0 (U3.U9), DVC (J6.35)
MOSI1: CPU-0 (U3.R9), DVC (J6.36)
nGCS1: CPU-0 (U3.E15), 02-Memory (J1.39 U10.4)
nGCS2: CPU-0 (U3.E16), DM (U11.37)
nGCS3: CPU-0 (U3.E14), 02-Memory (J1.37 U10.1)
nGCS4: CPU-0 (U3.E17), 02-Memory (J1.38 U10.2)
nGCS5: CPU-0 (U3.F15), 02-Memory (J1.40 U10.5)
nSCS0: CPU-0 (U3.F16), 02-Memory (U4.19)
nWAIT: CPU-0 (R1.1 U3.G13), 02-Memory (J1.43)
nXPON: CPU-0 (U3.U11), DVC (U15.3)
nYPON: CPU-0 (U3.M11), DVC (U16.3)
PDN0: CPU-0 (R40.1), 02-Memory (U3.N11)
PDP0: CPU-0 (R41.1), 02-Memory (U3.M10)
RXD2: CPU-0 (U3.K12), 02-Memory (J2.8)
SPICLK1: CPU-0 (U3.R10), DVC (J6.37)
TCLK1: CPU-0 (U3.R11), 02-Memory (J2.11)
TXD2: CPU-0 (U3.K13), 02-Memory (J2.6)
VCLK: CPU-0 (U3.J2), DVC (J6.13)
VD3: CPU-0 (U3.M3), DVC (J6.15)
VD4: CPU-0 (U3.M4), DVC (J6.16)
VD5: CPU-0 (U3.M2), DVC (J6.17)
VD6: CPU-0 (U3.N1), DVC (J6.18)
VD7: CPU-0 (U3.N3), DVC (J6.19)
VD10: CPU-0 (U3.P1), DVC (J6.21)
VD11: CPU-0 (U3.P3), DVC (J6.22)
VD12: CPU-0 (U3.P2), DVC (J6.23)
VD13: CPU-0 (U3.T1), DVC (J6.24)
VD14: CPU-0 (U3.R2), DVC (J6.25)
VD15: CPU-0 (U3.U1), DVC (J6.26)
VD19: CPU-0 (U3.U2), DVC (J6.28)
VD20: CPU-0 (U3.T3), DVC (J6.29)
VD21: CPU-0 (U3.U3), DVC (J6.30)
VD22: CPU-0 (U3.T4), DVC (J6.31)
VD23: CPU-0 (U3.P4), DVC (J6.32)
VF-VS: CPU-0 (U3.K4), DVC (J6.10)
VL-HS: CPU-0 (U3.J6), DVC (J6.11)
VM-VDEN: CPU-0 (U3.K2), DVC (J6.9)
XMON: CPU-0 (U3.P11), DVC (U15.1)
XTIPLL: CPU-0 (C3.1 X1.2), 02-Memory (U3.H17)
XTIRTC: CPU-0 (C5.1 X2.2), 02-Memory (U3.P16)
XTOPLL: CPU-0 (C4.1 X1.1), 02-Memory (U3.H16)
XTORTC: CPU-0 (C6.1 X2.1), 02-Memory (U3.R17)
YMON: CPU-0 (U3.T11), DVC (U16.1)